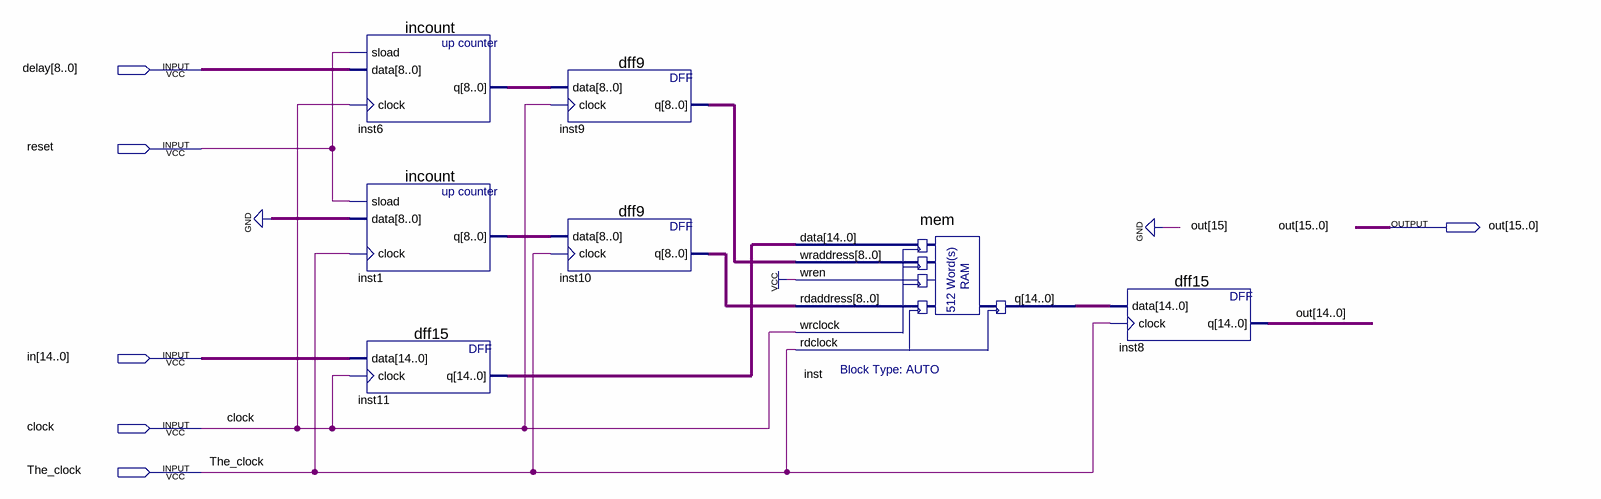
[diagram p0: schematic sheet]
// Quartus schematic Basic_DAQ_Block_trigg.bdf as structural Verilog: 7 symbols, 6 pins
module Basic_DAQ_Block_trigg (
  input  [8:0] delay,
  input  reset,
  input  [14:0] in,
  input  clock,
  input  The_clock,
  output [15:0] out
);

  wire [8:0] inst1_q, inst6_q, inst9_q, inst10_q;
  wire [14:0] inst11_q, inst_q;

  incount inst6 (.sload(reset), .data(delay), .clock(clock), .q(inst6_q));
  incount inst1 (.sload(reset), .data({9{1'b0}}), .clock(The_clock), .q(inst1_q));
  dff15 inst11 (.data(in), .clock(clock), .q(inst11_q));
  dff9 inst9 (.data(inst6_q), .clock(clock), .q(inst9_q));
  dff9 inst10 (.data(inst1_q), .clock(The_clock), .q(inst10_q));
  mem inst (
    .data(inst11_q), .wraddress(inst9_q), .wren(1'b1), .rdaddress(inst10_q), .wrclock(clock),
    .rdclock(The_clock), .q(inst_q));
  dff15 inst8 (.data(inst_q), .clock(The_clock), .q(out[14:0]));

  assign out[15] = 1'b0;
endmodule
